# Altium project PCB_Project.PrjPcb
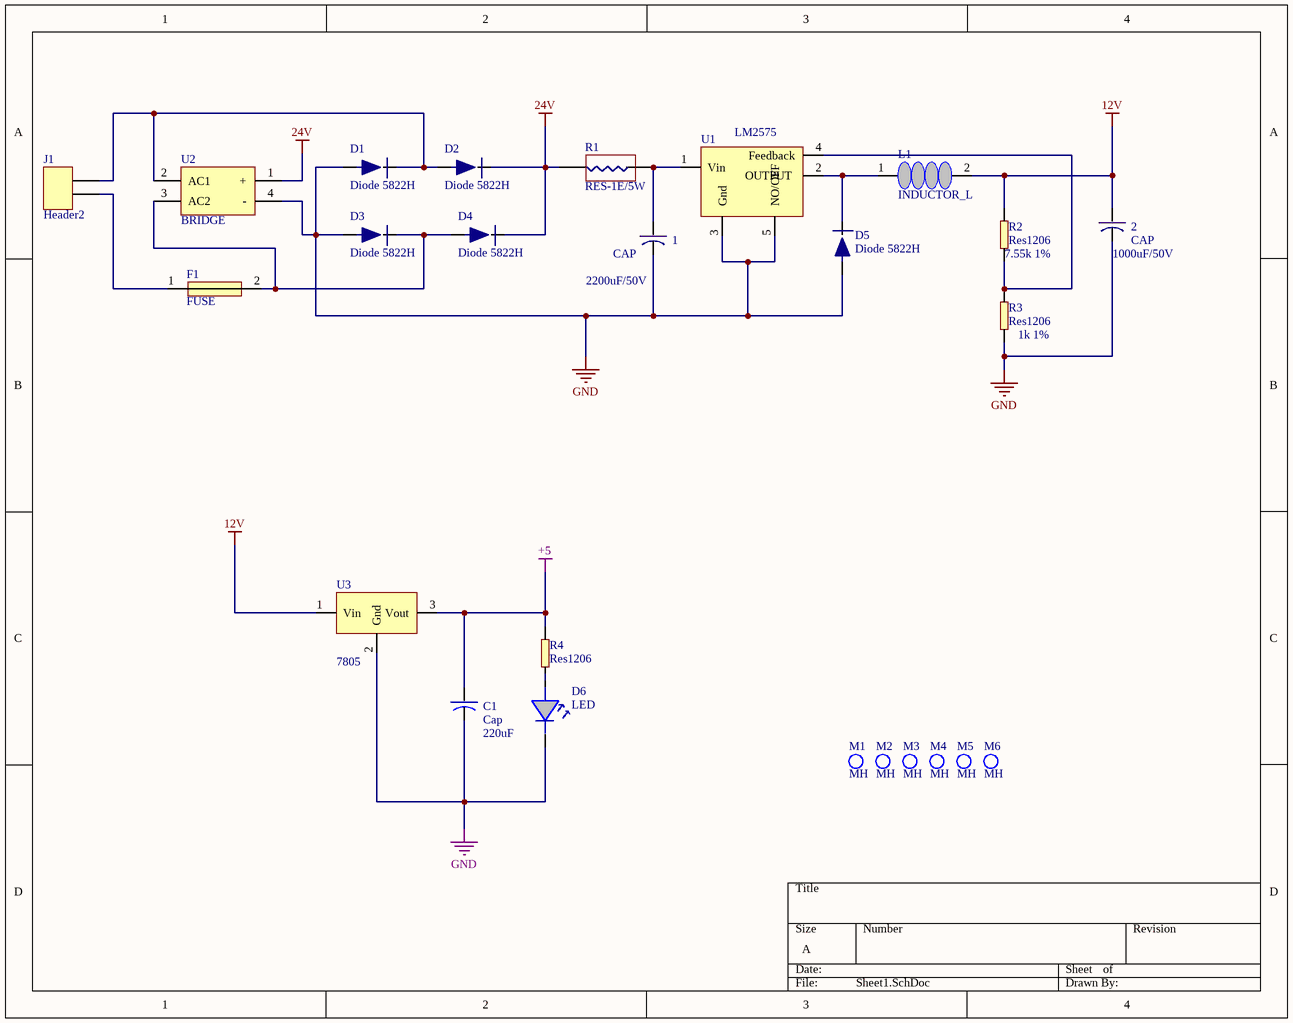
[diagram p0: Sheet1.SchDoc]
6 sheets, 125 parts. Net scope: global (net labels, ports and power ports of the same name join across sheets).
Board file: PCB.PcbDoc
Sheets:
  Sheet1.SchDoc
  Sheet2.SchDoc
  Sheet3.SchDoc
  Sheet4.SchDoc
  Sheet5.SchDoc
  Sheet6.SchDoc

## Sheet Sheet1.SchDoc
size A

### Parts
1  CAP  value 2200uF/50V  [Capacitor - 2200uF]
2  CAP  value 1000uF/50V  [Capacitor1000uF]
C1  Cap  [CAP_220uF]
D1  Diode 5822H  [Diode]
D2  Diode 5822H  [Diode]
D3  Diode 5822H  [Diode]
D4  Diode 5822H  [Diode]
D5  Diode 5822H  [Diode]
D6  LED  [LED5MM]
F1  FUSE  [FUSE]
J1  Header2  [Header2]
L1  INDUCTOR_L  [inductor-200mil]
M1  MH  [Mounting hole]
M2  MH  [Mounting hole]
M3  MH  [Mounting hole]
M4  MH  [Mounting hole]
M5  MH  [Mounting hole]
M6  MH  [Mounting hole]
R1  RES-1E/5W  [RES-1E/5W]
R2  Res1206  value 7.55k 1%  [1206]
R3  Res1206  value 1k 1%  [1206]
R4  Res1206  [1206]
U1  LM2575  [D2PAK_5PIN]
U2  BRIDGE  [BRIDGE_200MIL]
U3  7805  [D-PAK]

### Nets
12V: 2.1(a) L1.2(b) R2.2(b) U3.1(Vin)
24V: D2.2 D4.2 R1.1 U2.1(+)
+5: C1.1(a) R4.2(b) U3.3(Vout)
GND: 1.2(b) 2.2(b) C1.2(b) D1.1 D3.1 D5.1 D6.2(B) R3.1(a) U1.3(Gnd) U1.5(NO/OFF) U2.4(-) U3.2(Gnd)
Net1_1: 1.1(a) R1.2 U1.1(Vin)
NetD1_2: D1.2 D2.1 J1.2 U2.2(AC1)
NetD3_2: D3.2 D4.1 F1.2(B) U2.3(AC2)
NetD5_2: D5.2 L1.1(a) U1.2(OUTPUT)
NetD6_1: D6.1(A) R4.1(a)
NetF1_1: F1.1(A) J1.1
NetR2_1: R2.1(a) R3.2(b) U1.4(Feedback)

### Notes on the sheet
- (in symbol CAP_220uF) 220uF

### Library data of the parts
1 2 = 2200uF/50V
C1 = CAP_220uF
D6 = LED_5MM
L1 = Inductor-200
U1 = LM2575: Vol Reg
U3 = 7805: Vol Reg

## Sheet Sheet2.SchDoc
size A
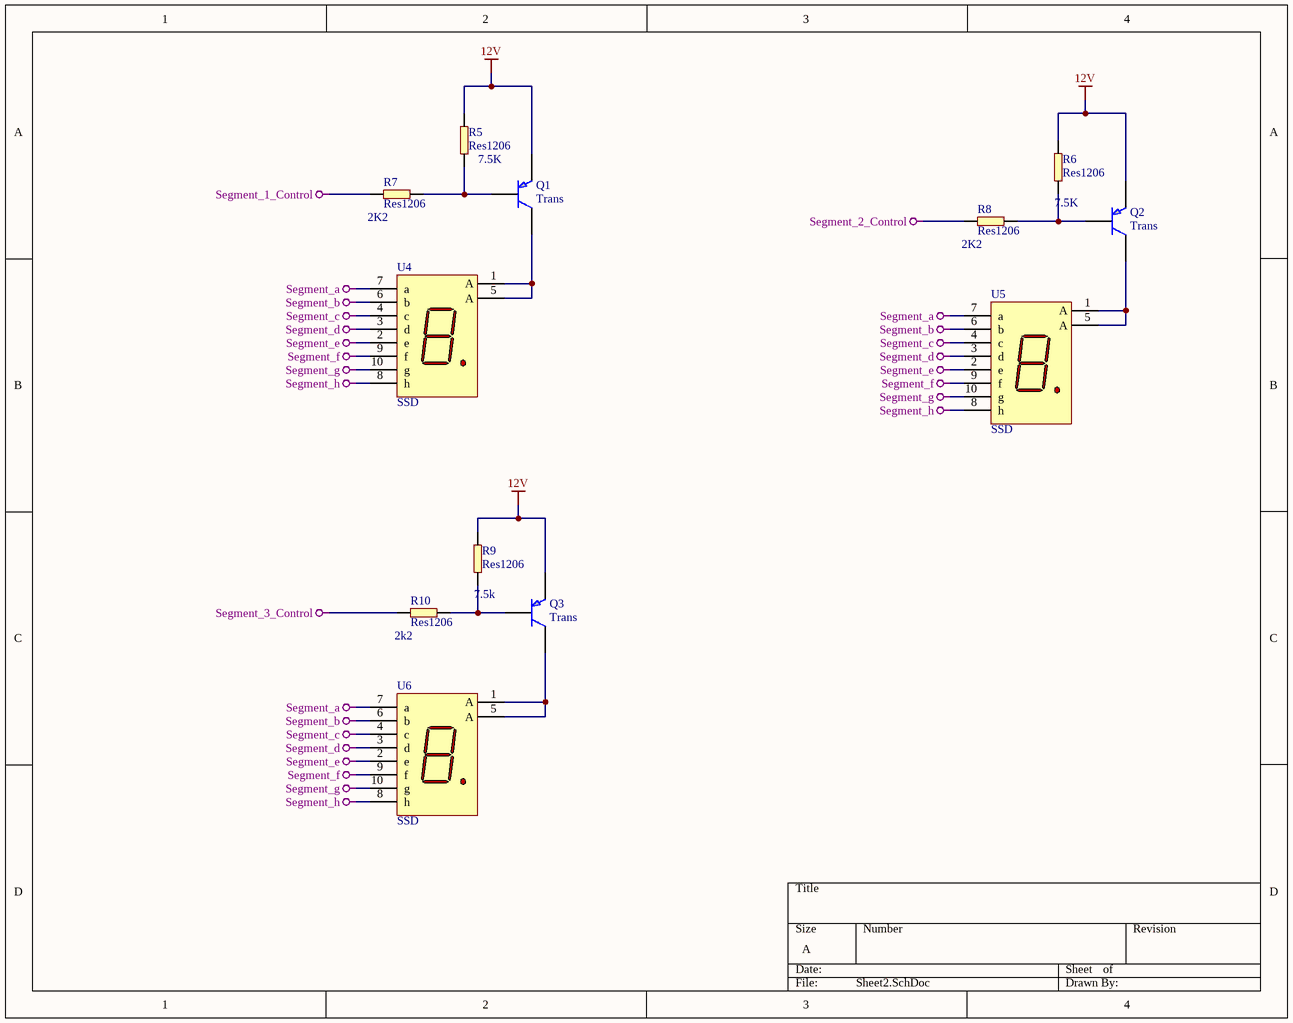
[diagram p1: Sheet2.SchDoc]

### Parts
Q1  Trans  [2N6107]
Q2  Trans  [2N6107]
Q3  Trans  [2N6107]
R5  Res1206  value 7.5K  [1206]
R6  Res1206  value 7.5K  [1206]
R7  Res1206  value 2K2  [1206]
R8  Res1206  value 2K2  [1206]
R9  Res1206  value 7.5k  [1206]
R10  Res1206  value 2k2  [1206]
U4  SSD  [SP1802_SSD]
U5  SSD  [SP1802_SSD]
U6  SSD  [SP1802_SSD]

### Nets
12V: Q1.3(E) Q2.3(E) Q3.3(E) R5.1(a) R6.2(b) R9.2(b)
Segment_1_Control: R7.2(b)
Segment_2_Control: R8.1(a)
Segment_3_Control: R10.1(a)
Segment_a: U4.7(a) U5.7(a) U6.7(a)
Segment_b: U4.6(b) U5.6(b) U6.6(b)
Segment_c: U4.4(c) U5.4(c) U6.4(c)
Segment_d: U4.3(d) U5.3(d) U6.3(d)
Segment_e: U4.2(e) U5.2(e) U6.2(e)
Segment_f: U4.9(f) U5.9(f) U6.9(f)
Segment_g: U4.10(g) U5.10(g) U6.10(g)
Segment_h: U4.8(h) U5.8(h) U6.8(h)
NetQ1_1: Q1.1(B) R5.2(b) R7.1(a)
NetQ1_2: Q1.2(C) U4.1(A) U4.5(A)
NetQ2_1: Q2.1(B) R6.1(a) R8.2(b)
NetQ2_2: Q2.2(C) U5.1(A) U5.5(A)
NetQ3_1: Q3.1(B) R9.1(a) R10.2(b)
NetQ3_2: Q3.2(C) U6.1(A) U6.5(A)

### Library data of the parts
Q1-Q3 = 2N6107: pnp transistor
U4-U6 = SP1802: SSD 48MM

## Sheet Sheet3.SchDoc
size A
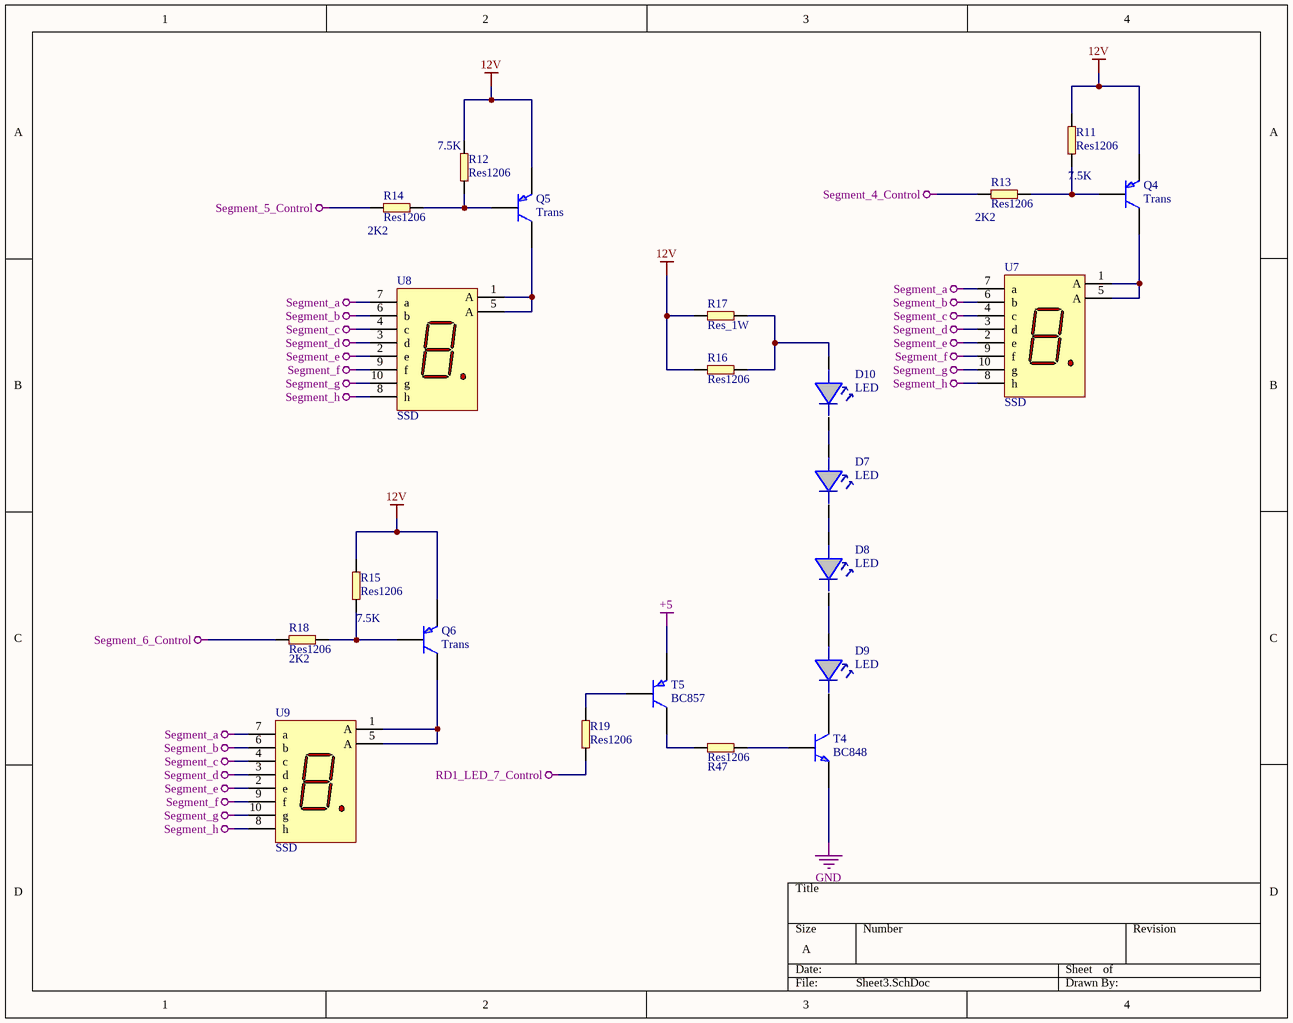
[diagram p2: Sheet3.SchDoc]

### Parts
D7  LED  [LED5MM]
D8  LED  [LED5MM]
D9  LED  [LED5MM]
D10  LED  [LED5MM]
Q4  Trans  [2N6107]
Q5  Trans  [2N6107]
Q6  Trans  [2N6107]
R11  Res1206  value 7.5K  [1206]
R12  Res1206  value 7.5K  [1206]
R13  Res1206  value 2K2  [1206]
R14  Res1206  value 2K2  [1206]
R15  Res1206  value 7.5K  [1206]
R16  Res1206  [1206]
R17  Res_1W  [RES_400_1W]
R18  Res1206  value 2K2  [1206]
R19  Res1206  [1206]
R47  Res1206  [1206]
T4  BC848  [SOT23]
T5  BC857  [SOT23]
U7  SSD  [SP1802_SSD]
U8  SSD  [SP1802_SSD]
U9  SSD  [SP1802_SSD]

### Nets
12V: Q4.3(E) Q5.3(E) Q6.3(E) R11.2(b) R12.1(a) R15.2(b) R16.1(a) R17.2(b)
+5: T5.2(E)
GND: T4.2(E)
RD1_LED_7_Control: R19.2(b)
Segment_4_Control: R13.1(a)
Segment_5_Control: R14.2(b)
Segment_6_Control: R18.1(a)
Segment_a: U7.7(a) U8.7(a) U9.7(a)
Segment_b: U7.6(b) U8.6(b) U9.6(b)
Segment_c: U7.4(c) U8.4(c) U9.4(c)
Segment_d: U7.3(d) U8.3(d) U9.3(d)
Segment_e: U7.2(e) U8.2(e) U9.2(e)
Segment_f: U7.9(f) U8.9(f) U9.9(f)
Segment_g: U7.10(g) U8.10(g) U9.10(g)
Segment_h: U7.8(h) U8.8(h) U9.8(h)
NetD7_1: D7.1(A) D10.2(B)
NetD7_2: D7.2(B) D8.1(A)
NetD8_2: D8.2(B) D9.1(A)
NetD9_2: D9.2(B) T4.3(C)
NetD10_1: D10.1(A) R16.2(b) R17.1(a)
NetQ4_1: Q4.1(B) R11.1(a) R13.2(b)
NetQ4_2: Q4.2(C) U7.1(A) U7.5(A)
NetQ5_1: Q5.1(B) R12.2(b) R14.1(a)
NetQ5_2: Q5.2(C) U8.1(A) U8.5(A)
NetQ6_1: Q6.1(B) R15.1(a) R18.2(b)
NetQ6_2: Q6.2(C) U9.1(A) U9.5(A)
NetR19_1: R19.1(a) T5.1(B)
NetR47_1: R47.1(a) T4.1(B)
NetR47_2: R47.2(b) T5.3(C)

### Library data of the parts
D7-D10 = LED_5MM
Q4-Q6 = 2N6107: pnp transistor
T4 = BC848: TRANSISTOR
U7-U9 = SP1802: SSD 48MM

## Sheet Sheet4.SchDoc
size A
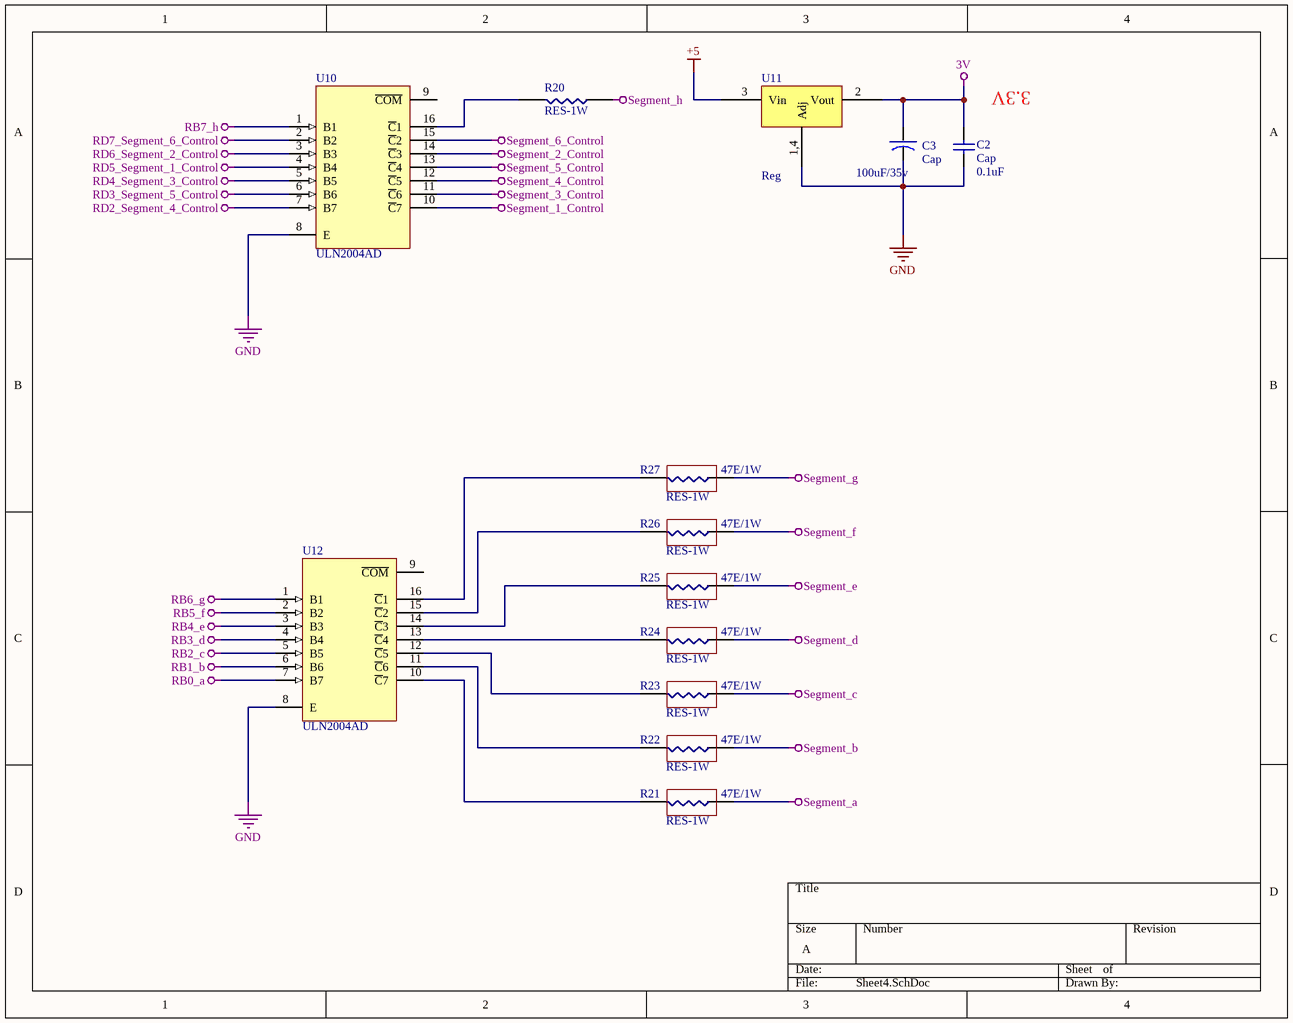
[diagram p3: Sheet4.SchDoc]

### Parts
C2  Cap  [RES0805]
C3  Cap  value 100uF/35v  [Capacitor10UF/63V]
R20  RES-1W  [RES-1W]
R21  RES-1W  value 47E/1W  [RES-1W]
R22  RES-1W  value 47E/1W  [RES-1W]
R23  RES-1W  value 47E/1W  [RES-1W]
R24  RES-1W  value 47E/1W  [RES-1W]
R25  RES-1W  value 47E/1W  [RES-1W]
R26  RES-1W  value 47E/1W  [RES-1W]
R27  RES-1W  value 47E/1W  [RES-1W]
U10  ULN2004AD  [D016_N]
U11  Reg  [LM1117]
U12  ULN2004AD  [D016_N]

### Nets
3V: C2.2(A) C3.1(a) U11.2(Vout)
+5: U11.3(Vin)
GND: C2.1(A) C3.2(b) U10.8(E) U11.1,4(Adj) U12.8(E)
RB0_a: U12.7(B7)
RB1_b: U12.6(B6)
RB2_c: U12.5(B5)
RB3_d: U12.4(B4)
RB4_e: U12.3(B3)
RB5_f: U12.2(B2)
RB6_g: U12.1(B1)
RB7_h: U10.1(B1)
RD2_Segment_4_Control: U10.7(B7)
RD3_Segment_5_Control: U10.6(B6)
RD4_Segment_3_Control: U10.5(B5)
RD5_Segment_1_Control: U10.4(B4)
RD6_Segment_2_Control: U10.3(B3)
RD7_Segment_6_Control: U10.2(B2)
Segment_1_Control: U10.10(~{C}7)
Segment_2_Control: U10.14(~{C}3)
Segment_3_Control: U10.11(~{C}6)
Segment_4_Control: U10.12(~{C}5)
Segment_5_Control: U10.13(~{C}4)
Segment_6_Control: U10.15(~{C}2)
Segment_a: R21.2
Segment_b: R22.2
Segment_c: R23.2
Segment_d: R24.2
Segment_e: R25.2
Segment_f: R26.2
Segment_g: R27.2
Segment_h: R20.2
NetR20_1: R20.1 U10.16(~{C}1)
NetR21_1: R21.1 U12.10(~{C}7)
NetR22_1: R22.1 U12.11(~{C}6)
NetR23_1: R23.1 U12.12(~{C}5)
NetR24_1: R24.1 U12.13(~{C}4)
NetR25_1: R25.1 U12.14(~{C}3)
NetR26_1: R26.1 U12.15(~{C}2)
NetR27_1: R27.1 U12.16(~{C}1)

Not connected (* = marked no-connect by the designer): U10 9(~{COM}); U12 9(~{COM})

### Notes on the sheet
- (near C2) 3.3V
- (in symbol CAP_104_SMD) 0.1uF

### Library data of the parts
C2 = CAP_104_SMD
C3 = Cap-10uf/63V: Cap10uf/63V
U10 U12 = ULN2004AD: Darlington Transistor Array; Published: 15-May-2002; LatestRevisionDate: 13-Apr-2006; LatestRevisionNote: IPC-7351 Footprint Added.; DatasheetVersion: Sep-1986; PackageVersion: Jan-1998; PackageReference: D016; Publisher: Altium Limited; PackageDescription: 16-Pin Small Outline Integrated Circuit 1.27 mm Pitch; Code_IPC: SOIC127P600-16; ComponentLink1Description: Manufacturer Link; ComponentLink1URL: http://www.ti.com/; ComponentLink2Description: Datasheet; ComponentLink2URL: http://www-s.ti.com/sc/ds/uln2004a.pdf
U11 = LM1117

## Sheet Sheet5.SchDoc
size A
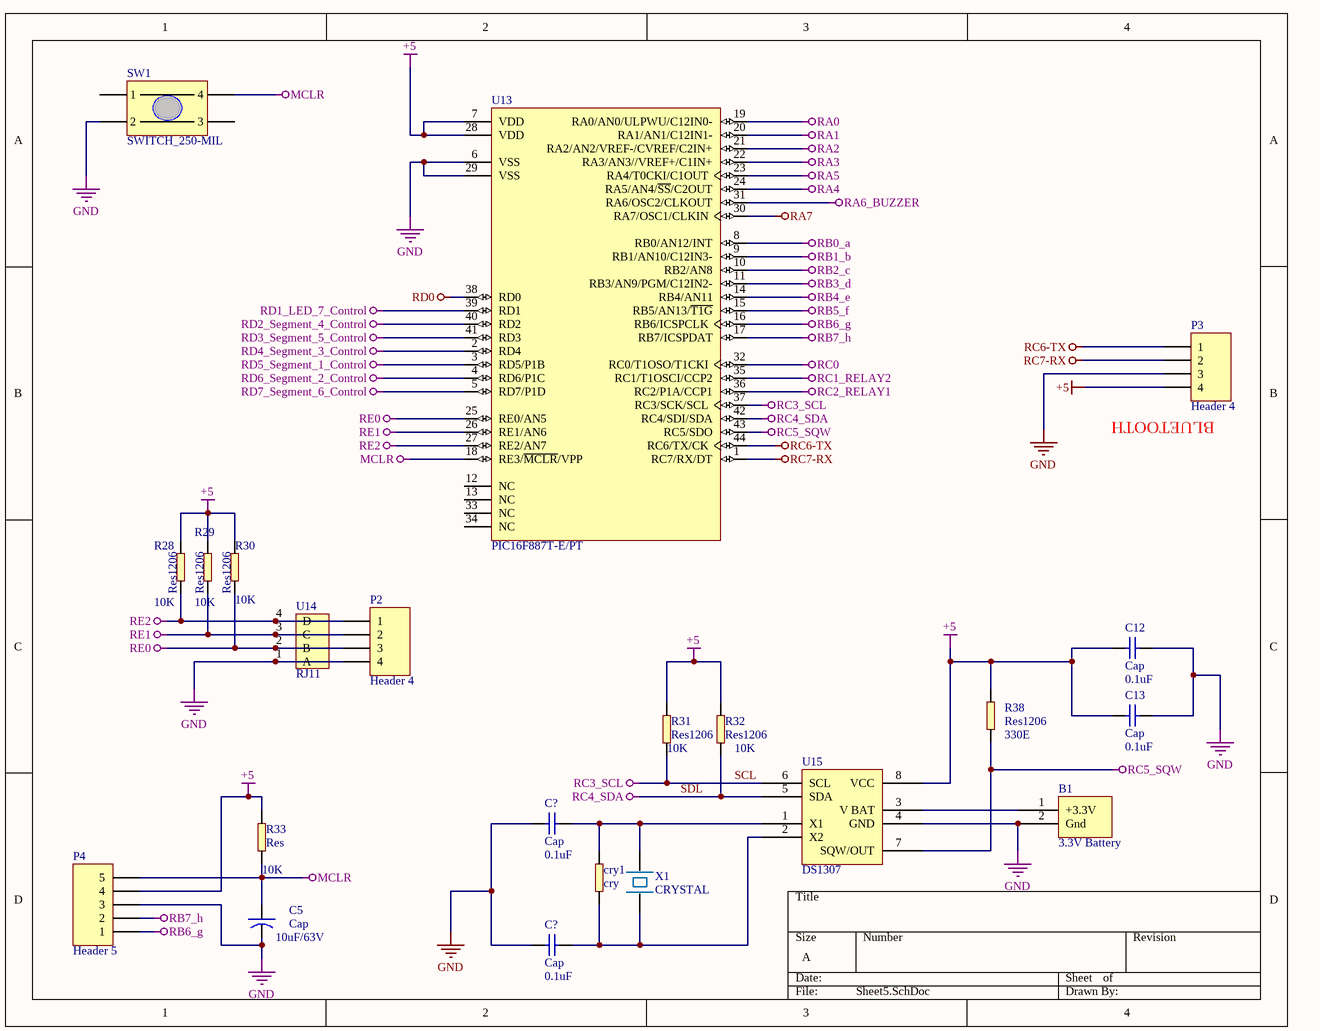
[diagram p4: Sheet5.SchDoc]

### Parts
(Parts that share a designator on the sheet are numbered #1, #2 ... from top to bottom, then left to right.)
B1  3.3V Battery  [CMOS_Battery_H]
C5  Cap  value 10uF/63V  [Capacitor10UF/63V]
C12  Cap  [RES0805]
C13  Cap  [RES0805]
C?#1  Cap  [RES0805]
C?#2  Cap  [RES0805]
cry1  cry  [Res_150mil]
P2  Header 4  [HDR1X4]
P3  Header 4  [HDR1X4]
P4  Header 5  [HDR1X5]
R28  Res1206  value 10K  [1206]
R29  Res1206  value 10K  [1206]
R30  Res1206  value 10K  [1206]
R31  Res1206  value 10K  [1206]
R32  Res1206  value 10K  [1206]
R33  Res  value 10K  [RES0805]
R38  Res1206  value 330E  [1206]
SW1  SWITCH_250-MIL  [switch_200/250]
U13  PIC16F887T-E/PT  [TQFP-PT44_N]
U14  RJ11  [RJ11]
U15  DS1307  [SOIC1307]
X1  CRYSTAL  [CRYSTAL]

### Nets
+5: C12.2(A) C13.2(A) P3.4 P4.4 R28.2(b) R29.2(b) R30.2(b) R31.2(b) R32.2(b) R33.2(b) R38.2(b) U13.7(VDD) U13.28(VDD) U15.8(VCC)
GND: B1.2(Gnd) C5.2(b) C12.1(A) C13.1(A) C?#1.2(A) C?#2.2(A) P2.4 P3.3 P4.3 SW1.2 U13.6(VSS) U13.29(VSS) U14.1(A) U15.4(GND)
MCLR: C5.1(a) P4.5 R33.1(a) SW1.4 U13.18(RE3/~{MCLR}/VPP)
RA0: U13.19(RA0/AN0/ULPWU/C12IN0-)
RA1: U13.20(RA1/AN1/C12IN1-)
RA2: U13.21(RA2/AN2/VREF-/CVREF/C2IN+)
RA3: U13.22(RA3/AN3//VREF+/C1IN+)
RA4: U13.24(RA5/AN4/~{SS}/C2OUT)  [project net RE]
RA5: U13.23(RA4/T0CKI/C1OUT)  [project net DE]
RA6_BUZZER: U13.31(RA6/OSC2/CLKOUT)
RA7: U13.30(RA7/OSC1/CLKIN)
RB0_a: U13.8(RB0/AN12/INT)
RB1_b: U13.9(RB1/AN10/C12IN3-)
RB2_c: U13.10(RB2/AN8)
RB3_d: U13.11(RB3/AN9/PGM/C12IN2-)
RB4_e: U13.14(RB4/AN11)
RB5_f: U13.15(RB5/AN13/~{T1G})
RB6_g: P4.1 U13.16(RB6/ICSPCLK)
RB7_h: P4.2 U13.17(RB7/ICSPDAT)
RC0: U13.32(RC0/T1OSO/T1CKI)
RC1_RELAY2: U13.35(RC1/T1OSCI/CCP2)
RC2_RELAY1: U13.36(RC2/P1A/CCP1)
RC5_SQW: R38.1(a) U13.43(RC5/SDO) U15.7(SQW/OUT)
RC6-TX: P3.1 U13.44(RC6/TX/CK)
RC7-RX: P3.2 U13.1(RC7/RX/DT)
RD0: U13.38(RD0)
RD1_LED_7_Control: U13.39(RD1)
RD2_Segment_4_Control: U13.40(RD2)
RD3_Segment_5_Control: U13.41(RD3)
RD4_Segment_3_Control: U13.2(RD4)
RD5_Segment_1_Control: U13.3(RD5/P1B)
RD6_Segment_2_Control: U13.4(RD6/P1C)
RD7_Segment_6_Control: U13.5(RD7/P1D)
RE0: P2.3 R30.1(a) U13.25(RE0/AN5) U14.2(B)
RE1: P2.2 R29.1(a) U13.26(RE1/AN6) U14.3(C)
RE2: P2.1 R28.1(a) U13.27(RE2/AN7) U14.4(D)
SCL: R31.1(a) U13.37(RC3/SCK/SCL) U15.6(SCL)  [also labelled RC3_SCL]
SDL: R32.1(a) U13.42(RC4/SDI/SDA) U15.5(SDA)  [also labelled RC4_SDA]
NetB1_1: B1.1(+3.3V) U15.3(V_BAT)
NetC?#1_1: C?#1.1(A) cry1.2(b) U15.1(X1) X1.2(b)
NetC?#2_1: C?#2.1(A) cry1.1(a) U15.2(X2) X1.1(a)

Not connected (* = marked no-connect by the designer): SW1 1 3; U13 12(NC) 13(NC) 33(NC) 34(NC)

### Notes on the sheet
- (near P3) BLUETOOTH
- (in symbol CAP_104_SMD) 0.1uF

### Library data of the parts
B1 = CMOS Battery_H: 3.3V
C5 = Cap-10uf/63V: Cap10uf/63V
C12 C13 C?#1 C?#2 = CAP_104_SMD
cry1 = Res vertical placement
P2 P3 = Header 4: Header, 4-Pin; LatestRevisionDate: 17-Jul-2002; LatestRevisionNote: Re-released for DXP Platform.; Publisher: Altium Limited
P4 = Header 5: Header, 5-Pin; LatestRevisionDate: 17-Jul-2002; LatestRevisionNote: Re-released for DXP Platform.; Publisher: Altium Limited
R33 = Resistor: Res0805
SW1 = SWITCH_250-MIL: 200/250mil Didtance
U13 = PIC16F887T-E/PT: Flash-Based, 8-Bit CMOS Microcontroller with nanoWatt Technology, 8K (x14-Bit words) Program Memory, 624 Bytes Data Memory, 35 I/O pins, 44-Pin TQFP, Standard VDD Range, Extended Temperature, Tape and Reel; Published: 29-Jan-2009; LatestRevisionDate: 02-Dec-2009; LatestRevisionNote: Updated datasheet to version revF, Apr-2009.; DatasheetVersion: revF, Apr-2009; PackageVersion: revBB, Aug-2009; PackageReference: TQFP-PT44; Publisher: Altium Limited; PackageDescription: 44-Lead Plastic Thin Quad Flatpack (PT) - 10x10x1mm Body, 2.00mm [TQFP]; Code_JEDEC: MS-026; ComponentLink1Description: Datasheet; ComponentLink1URL: http://ww1.microchip.com/downloads/en/DeviceDoc/41291F.pdf; ComponentLink2Description: Packaging Specification; ComponentLink2URL: http://www.microchip.com/stellent/groups/techpub_sg/documents/packagingspec/en012702.pdf; ComponentLink3Description: Microchip.com Home; ComponentLink3URL: http://www.microchip.com/
U14 = RJ11 conn

## Sheet Sheet6.SchDoc
size B
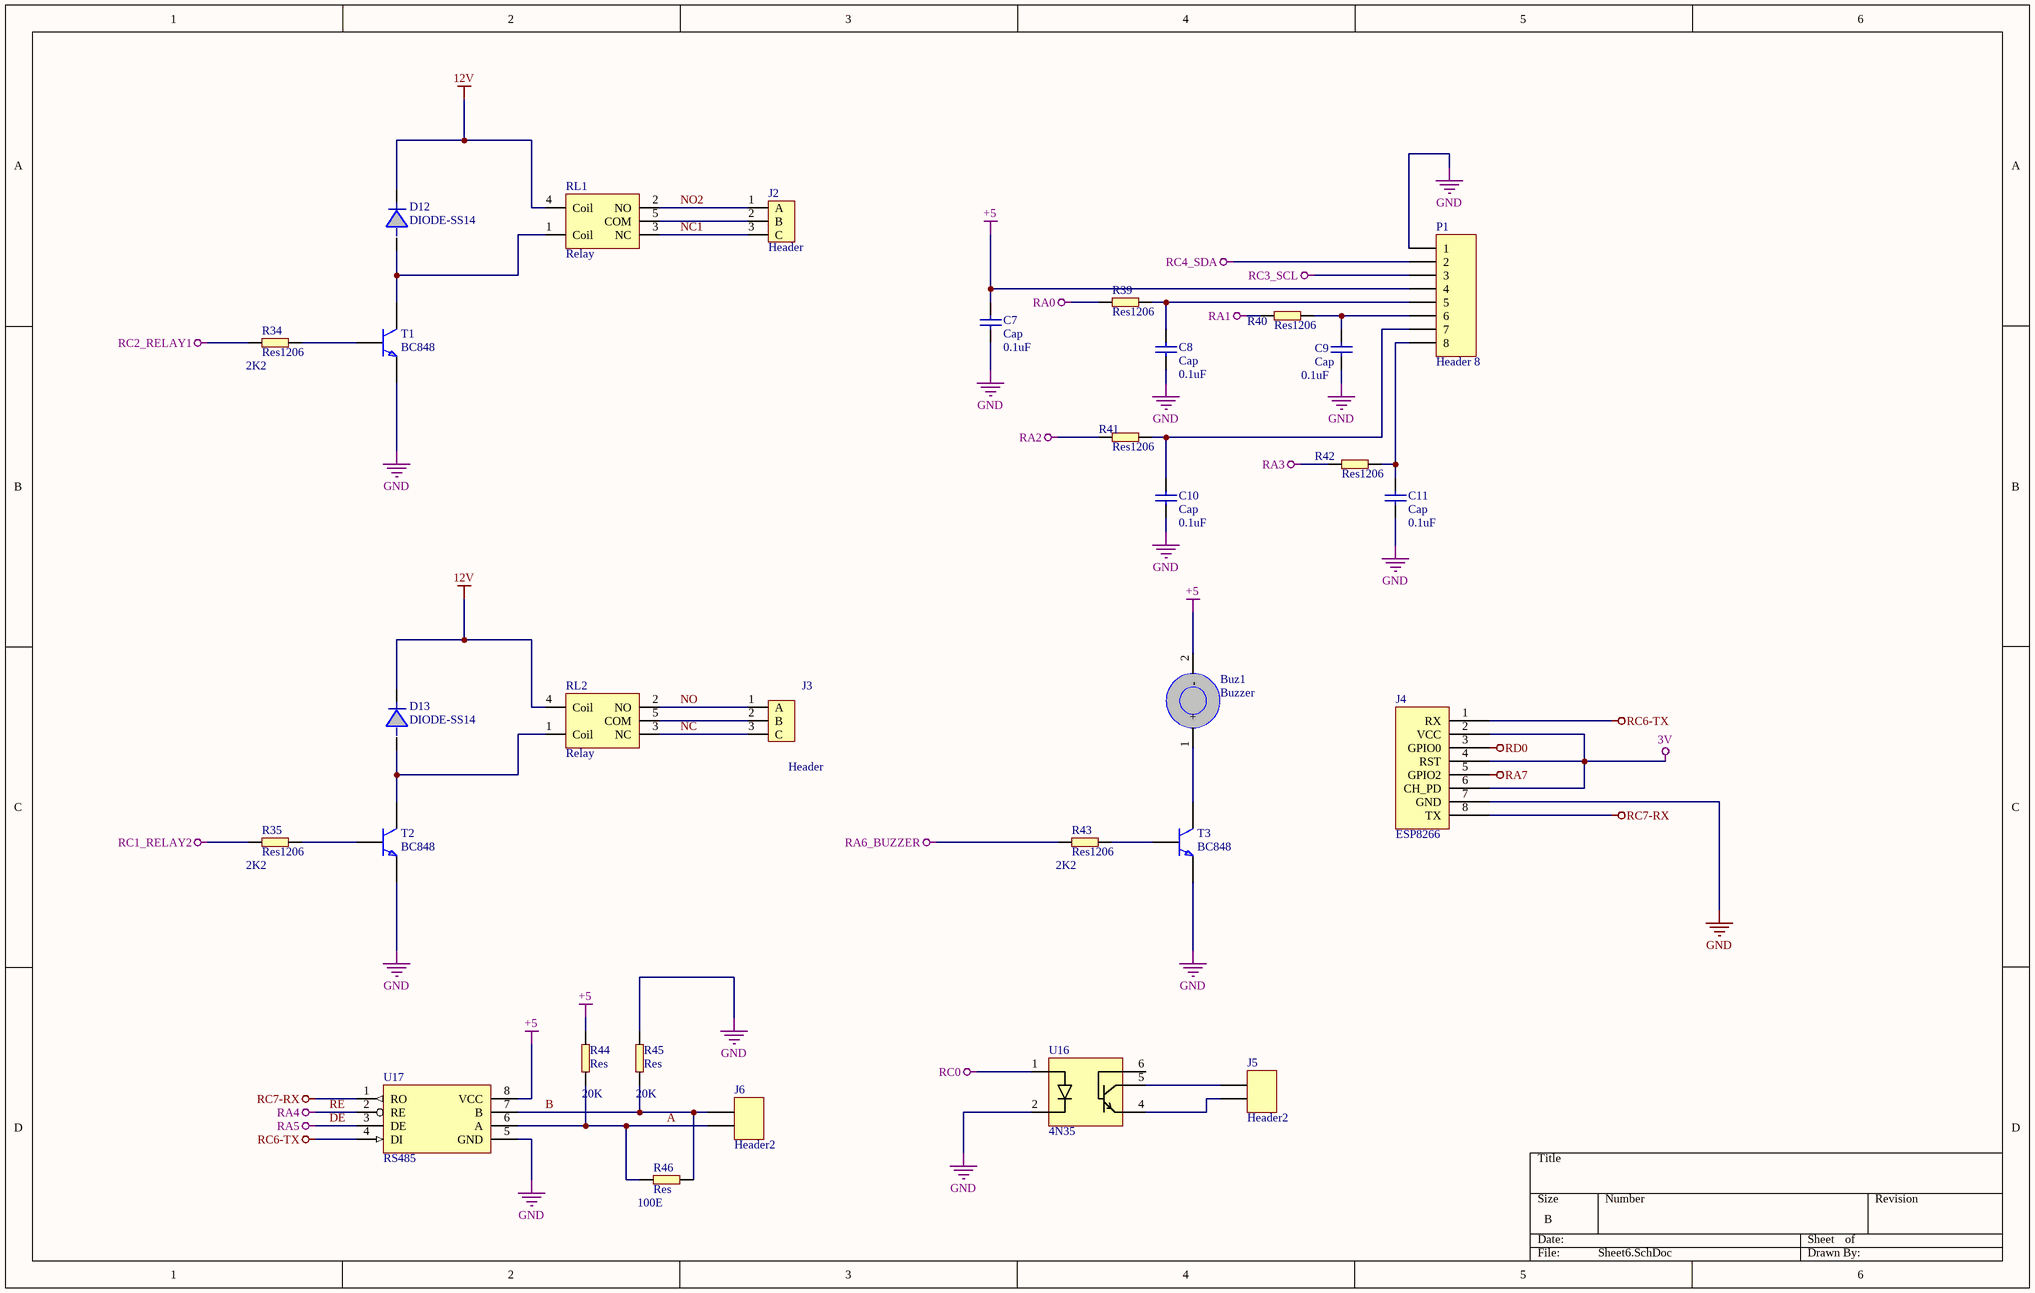
[diagram p5: Sheet6.SchDoc]

### Parts
Buz1  Buzzer  [Buzzer]
C7  Cap  [1206]
C8  Cap  [RES0805]
C9  Cap  [RES0805]
C10  Cap  [RES0805]
C11  Cap  [RES0805]
D12  DIODE-SS14  [DO-214AC]
D13  DIODE-SS14  [DO-214AC]
J2  Header  [HEADER AC SMALL]
J3  Header  [HEADER AC SMALL]
J4  ESP8266  [ESP8266]
J5  Header2  [Header2]
J6  Header2  [Header2]
P1  Header 8  [HDR1X8]
R34  Res1206  value 2K2  [1206]
R35  Res1206  value 2K2  [1206]
R39  Res1206  [1206]
R40  Res1206  [1206]
R41  Res1206  [1206]
R42  Res1206  [1206]
R43  Res1206  value 2K2  [1206]
R44  Res  value 20K  [RES0805]
R45  Res  value 20K  [RES0805]
R46  Res  value 100E  [RES0805]
RL1  Relay  [Relay]
RL2  Relay  [Relay]
T1  BC848  [SOT23]
T2  BC848  [SOT23]
T3  BC848  [SOT23]
U16  4N35  [4N35]
U17  RS485  [RS485]

### Nets
3V: J4.2(VCC) J4.4(RST) J4.6(CH_PD)
12V: D12.2(B) D13.2(B) RL1.4(Coil) RL2.4(Coil)
+5: Buz1.2(-) C7.2(A) P1.4 R44.2(b) U17.8(VCC)
DE: U17.3(DE)  [also labelled RA5]
GND: C7.1(A) C8.1(A) C9.1(A) C10.1(A) C11.1(A) J4.7(GND) P1.1 R45.2(b) T1.2(E) T2.2(E) T3.2(E) U16.2(B) U17.5(GND)
RA0: R39.2(b)
RA1: R40.2(b)
RA2: R41.2(b)
RA3: R42.2(b)
RA6_BUZZER: R43.2(b)
RA7: J4.5(GPIO2)
RC0: U16.1(A)
RC1_RELAY2: R35.1(a)
RC2_RELAY1: R34.1(a)
RC3_SCL: P1.3  [project net SCL]
RC4_SDA: P1.2  [project net SDL]
RC6-TX: J4.1(RX) U17.4(DI)
RC7-RX: J4.8(TX) U17.1(RO)
RD0: J4.3(GPIO0)
RE: U17.2(RE)  [also labelled RA4]
A: J6.2 R44.1(a) R46.1(a) U17.6(A)
B: J6.1 R45.1(a) R46.2(b) U17.7(B)
NC: J3.3(C) RL2.3(NC)
NC1: J2.3(C) RL1.3(NC)
NO: J3.1(A) RL2.2(NO)
NO2: J2.1(A) RL1.2(NO)
NetBuz1_1: Buz1.1(+) T3.3(C)
NetC8_2: C8.2(A) P1.5 R39.1(a)
NetC9_2: C9.2(A) P1.6 R40.1(a)
NetC10_2: C10.2(A) P1.7 R41.1(a)
NetC11_2: C11.2(A) P1.8 R42.1(a)
NetD12_1: D12.1(A) RL1.1(Coil) T1.3(C)
NetD13_1: D13.1(A) RL2.1(Coil) T2.3(C)
NetJ2_2: J2.2(B) RL1.5(COM)
NetJ3_2: J3.2(B) RL2.5(COM)
NetJ5_1: J5.1 U16.5(E)
NetJ5_2: J5.2 U16.4(D)
NetR34_2: R34.2(b) T1.1(B)
NetR35_2: R35.2(b) T2.1(B)
NetR43_1: R43.1(a) T3.1(B)

Not connected (* = marked no-connect by the designer): U16 6(F)

### Notes on the sheet
- (in symbol CAP_104_SMD) 0.1uF

### Library data of the parts
C7-C11 = CAP_104_SMD
D12 D13 = DIODE-SS14: SS14
J2 J3 = HEADER AC SMALL
J4 = ESP8266: WIFI Module
P1 = Header 8: Header, 8-Pin; LatestRevisionDate: 17-Jul-2002; LatestRevisionNote: Re-released for DXP Platform.; Publisher: Altium Limited
R44-R46 = Resistor: Res0805
RL1 RL2 = Relay: Relay 12V
T1-T3 = BC848: TRANSISTOR
U16 = 4N35: Optocoupler
U17 = RS485: 8-Pin SO

## Nets that join several sheets
3V: Sheet4 (C2.2 C3.1 U11.2), Sheet6 (J4.2 J4.4 J4.6)
12V: Sheet1 (2.1 L1.2 R2.2 U3.1), Sheet2 (6 pins), Sheet3 (8 pins), Sheet6 (D12.2 D13.2 RL1.4 RL2.4)
+5: Sheet1 (C1.1 R4.2 U3.3), Sheet3 (T5.2), Sheet4 (U11.3), Sheet5 (14 pins), Sheet6 (5 pins)
DE: Sheet5 (U13.23), Sheet6 (U17.3)
GND: Sheet1 (12 pins), Sheet3 (T4.2), Sheet4 (5 pins), Sheet5 (14 pins), Sheet6 (13 pins)
RA0: Sheet5 (U13.19), Sheet6 (R39.2)
RA1: Sheet5 (U13.20), Sheet6 (R40.2)
RA2: Sheet5 (U13.21), Sheet6 (R41.2)
RA3: Sheet5 (U13.22), Sheet6 (R42.2)
RA6_BUZZER: Sheet5 (U13.31), Sheet6 (R43.2)
RA7: Sheet5 (U13.30), Sheet6 (J4.5)
RB0_a: Sheet4 (U12.7), Sheet5 (U13.8)
RB1_b: Sheet4 (U12.6), Sheet5 (U13.9)
RB2_c: Sheet4 (U12.5), Sheet5 (U13.10)
RB3_d: Sheet4 (U12.4), Sheet5 (U13.11)
RB4_e: Sheet4 (U12.3), Sheet5 (U13.14)
RB5_f: Sheet4 (U12.2), Sheet5 (U13.15)
RB6_g: Sheet4 (U12.1), Sheet5 (P4.1 U13.16)
RB7_h: Sheet4 (U10.1), Sheet5 (P4.2 U13.17)
RC0: Sheet5 (U13.32), Sheet6 (U16.1)
RC1_RELAY2: Sheet5 (U13.35), Sheet6 (R35.1)
RC2_RELAY1: Sheet5 (U13.36), Sheet6 (R34.1)
RC6-TX: Sheet5 (P3.1 U13.44), Sheet6 (J4.1 U17.4)
RC7-RX: Sheet5 (P3.2 U13.1), Sheet6 (J4.8 U17.1)
RD0: Sheet5 (U13.38), Sheet6 (J4.3)
RD1_LED_7_Control: Sheet3 (R19.2), Sheet5 (U13.39)
RD2_Segment_4_Control: Sheet4 (U10.7), Sheet5 (U13.40)
RD3_Segment_5_Control: Sheet4 (U10.6), Sheet5 (U13.41)
RD4_Segment_3_Control: Sheet4 (U10.5), Sheet5 (U13.2)
RD5_Segment_1_Control: Sheet4 (U10.4), Sheet5 (U13.3)
RD6_Segment_2_Control: Sheet4 (U10.3), Sheet5 (U13.4)
RD7_Segment_6_Control: Sheet4 (U10.2), Sheet5 (U13.5)
RE: Sheet5 (U13.24), Sheet6 (U17.2)
SCL: Sheet5 (R31.1 U13.37 U15.6), Sheet6 (P1.3)
SDL: Sheet5 (R32.1 U13.42 U15.5), Sheet6 (P1.2)
Segment_1_Control: Sheet2 (R7.2), Sheet4 (U10.10)
Segment_2_Control: Sheet2 (R8.1), Sheet4 (U10.14)
Segment_3_Control: Sheet2 (R10.1), Sheet4 (U10.11)
Segment_4_Control: Sheet3 (R13.1), Sheet4 (U10.12)
Segment_5_Control: Sheet3 (R14.2), Sheet4 (U10.13)
Segment_6_Control: Sheet3 (R18.1), Sheet4 (U10.15)
Segment_a: Sheet2 (U4.7 U5.7 U6.7), Sheet3 (U7.7 U8.7 U9.7), Sheet4 (R21.2)
Segment_b: Sheet2 (U4.6 U5.6 U6.6), Sheet3 (U7.6 U8.6 U9.6), Sheet4 (R22.2)
Segment_c: Sheet2 (U4.4 U5.4 U6.4), Sheet3 (U7.4 U8.4 U9.4), Sheet4 (R23.2)
Segment_d: Sheet2 (U4.3 U5.3 U6.3), Sheet3 (U7.3 U8.3 U9.3), Sheet4 (R24.2)
Segment_e: Sheet2 (U4.2 U5.2 U6.2), Sheet3 (U7.2 U8.2 U9.2), Sheet4 (R25.2)
Segment_f: Sheet2 (U4.9 U5.9 U6.9), Sheet3 (U7.9 U8.9 U9.9), Sheet4 (R26.2)
Segment_g: Sheet2 (U4.10 U5.10 U6.10), Sheet3 (U7.10 U8.10 U9.10), Sheet4 (R27.2)
Segment_h: Sheet2 (U4.8 U5.8 U6.8), Sheet3 (U7.8 U8.8 U9.8), Sheet4 (R20.2)